# Altium schematic sheet STM32F103C8T6.SchDoc
size A3
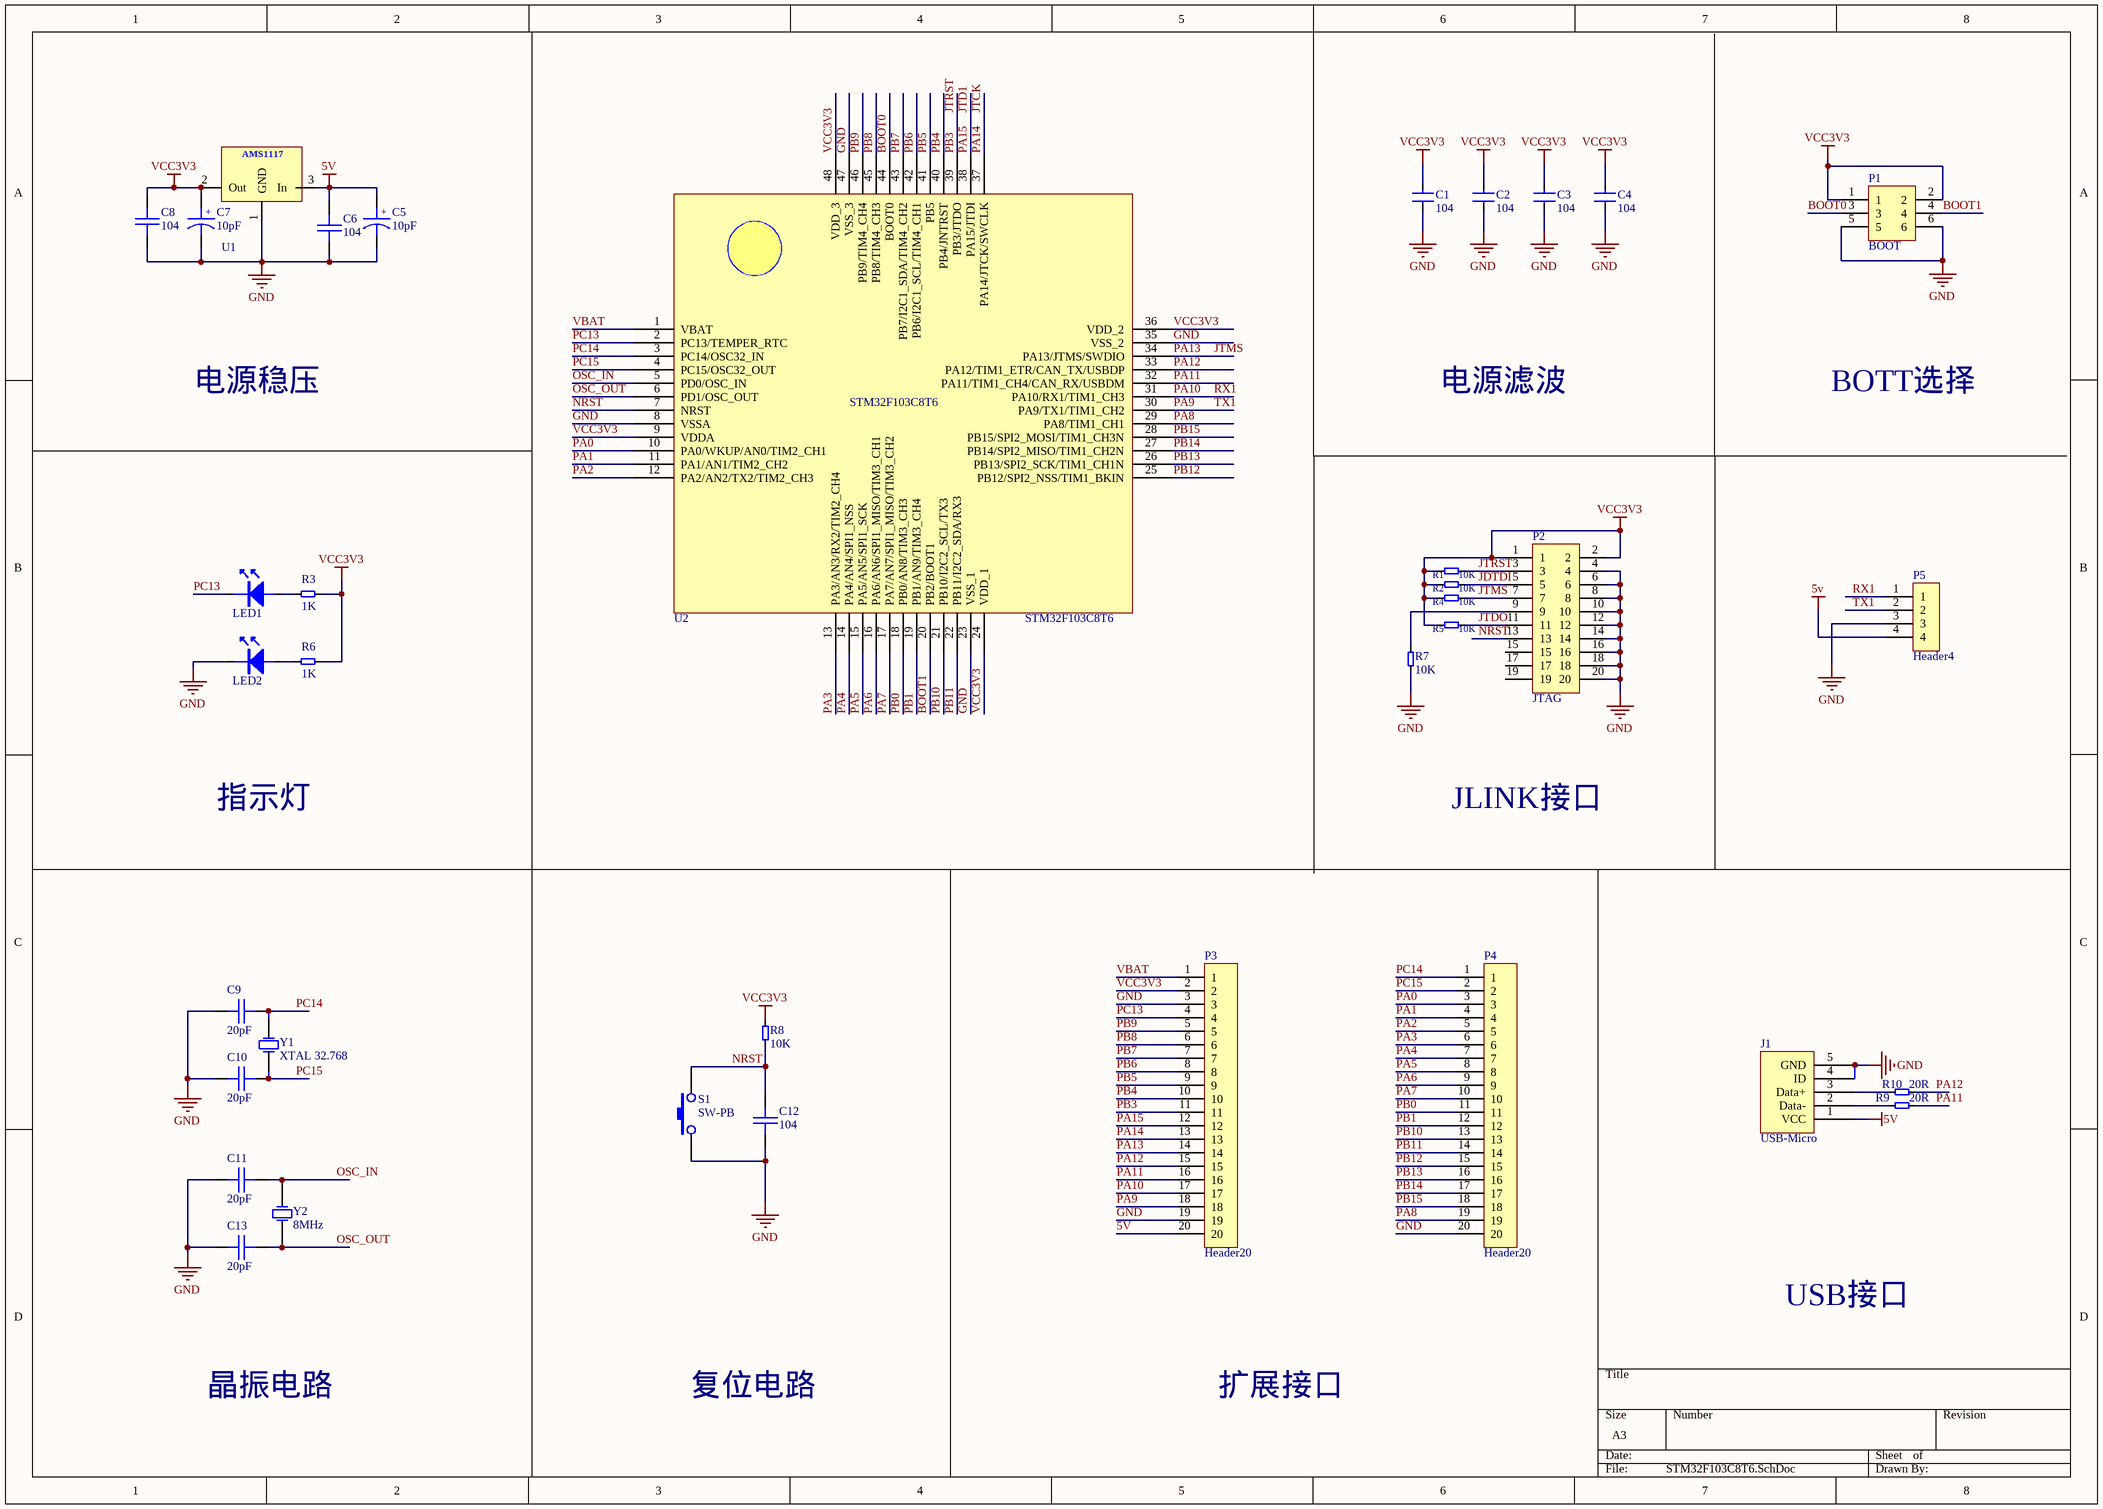
[diagram p0: STM32F103C8T6.SchDoc]

## Parts
C1  104  [0805C]
C2  104  [0805C]
C3  104  [0805C]
C4  104  [0805C]
C5  10pF  [SMT_C_Tantalum_B]
C6  104  [0805-0C]
C7  10pF  [SMT_C_Tantalum_B]
C8  104  [0805-0C]
C9  20pF  [0805-0C]
C10  20pF  [0805-0C]
C11  20pF  [0805-0C]
C12  104  [0805-0C]
C13  20pF  [0805-0C]
J1  USB-Micro  [USB-MICRO贴片]
LED1  SMT_LED_0805  [0805LED1]  (value not drawn)
LED2  SMT_LED_0805  [0805LED1]  (value not drawn)
P1  BOOT  [2.54排针2X3]
P2  JTAG  [2.54简易牛角座20p]
P3  Header20  [2.54排针1X20]
P4  Header20  [2.54排针1X20]
P5  Header4  [2.54排针1X4]
R1  10K  [R0805]
R2  10K  [R0805]
R3  1K  [R0805]
R4  10K  [R0805]
R5  10K  [R0805]
R6  1K  [R0805]
R7  10K  [R0805]
R8  10K  [R0805]
R9  20R  [R0805]
R10  20R  [R0805]
S1  SW-PB  [按键微动开关2]
U1  AMS1117  [AMS1117]  (value not drawn)
U2  STM32F103C8T6  [LQF48_M]
Y1  XTAL 32.768  [AT26]
Y2  8MHz  [TP_8M]

## Nets
5V: C5.1 C6.1 J1.1(VCC) P3.20 P5.4 U1.3(In)
GND: C1.2 C2.2 C3.2 C4.2 C5.2 C6.2 C7.2 C8.2 C9.1 C10.1 C11.1 C12.2 C13.1 J1.4(ID) J1.5(GND) LED2.2(K) P1.5 P1.6 P2.4 P2.6 P2.8 P2.10 P2.12 P2.14 P2.16 P2.18 P2.20 P3.3 P3.19 P4.20 P5.3 R7.1 S1.1 U1.1(GND) U2.8(VSSA) U2.23(VSS_1) U2.35(VSS_2) U2.47(VSS_3)
VCC3V3: C1.1 C2.1 C3.1 C4.1 C7.1 C8.1 P1.1 P1.2 P2.1 P2.2 P3.2 R1.1 R2.1 R3.2 R4.1 R5.1 R6.1 R8.2 U1.2(Out) U2.9(VDDA) U2.24(VDD_1) U2.36(VDD_2) U2.48(VDD_3)
BOOT0: P1.3 U2.44(BOOT0)
BOOT1: P1.4 U2.20(PB2/BOOT1)
JDTDI: P2.5 R2.2
JTCK: P3.13 U2.37(PA14/JTCK/SWCLK)  [also labelled PA14]
JTD1: P3.12 U2.38(PA15/JTDI)  [also labelled PA15]
JTDO: P2.11 R5.2
JTMS: P2.7 P3.14 R4.2 U2.34(PA13/JTMS/SWDIO)  [also labelled PA13]
JTRST: P2.3 P3.11 R1.2 U2.39(PB3/JTDO)  [also labelled PB3]
NRST: C12.1 P2.13 R8.1 S1.2 U2.7(NRST)
OSC_IN: C11.2 U2.5(PD0/OSC_IN) Y2.2
OSC_OUT: C13.2 U2.6(PD1/OSC_OUT) Y2.1
PA0: P4.3 U2.10(PA0/WKUP/AN0/TIM2_CH1)
PA1: P4.4 U2.11(PA1/AN1/TIM2_CH2)
PA2: P4.5 U2.12(PA2/AN2/TX2/TIM2_CH3)
PA3: P4.6 U2.13(PA3/AN3/RX2/TIM2_CH4)
PA4: P4.7 U2.14(PA4/AN4/SPI1_NSS)
PA5: P4.8 U2.15(PA5/AN5/SPI1_SCK)
PA6: P4.9 U2.16(PA6/AN6/SPI1_MISO/TIM3_CH1)
PA7: P4.10 U2.17(PA7/AN7/SPI1_MISO/TIM3_CH2)
PA8: P4.19 U2.29(PA8/TIM1_CH1)
PA9: P3.18 P5.2 U2.30(PA9/TX1/TIM1_CH2)  [also labelled TX1]
PA10: P3.17 P5.1 U2.31(PA10/RX1/TIM1_CH3)  [also labelled RX1]
PA11: P3.16 R9.2 U2.32(PA11/TIM1_CH4/CAN_RX/USBDM)
PA12: P3.15 R10.2 U2.33(PA12/TIM1_ETR/CAN_TX/USBDP)
PB0: P4.11 U2.18(PB0/AN8/TIM3_CH3)
PB1: P4.12 U2.19(PB1/AN9/TIM3_CH4)
PB4: P3.10 U2.40(PB4/JNTRST)
PB5: P3.9 U2.41(PB5)
PB6: P3.8 U2.42(PB6/I2C1_SCL/TIM4_CH1)
PB7: P3.7 U2.43(PB7/I2C1_SDA/TIM4_CH2)
PB8: P3.6 U2.45(PB8/TIM4_CH3)
PB9: P3.5 U2.46(PB9/TIM4_CH4)
PB10: P4.13 U2.21(PB10/I2C2_SCL/TX3)
PB11: P4.14 U2.22(PB11/I2C2_SDA/RX3)
PB12: P4.15 U2.25(PB12/SPI2_NSS/TIM1_BKIN)
PB13: P4.16 U2.26(PB13/SPI2_SCK/TIM1_CH1N)
PB14: P4.17 U2.27(PB14/SPI2_MISO/TIM1_CH2N)
PB15: P4.18 U2.28(PB15/SPI2_MOSI/TIM1_CH3N)
PC13: LED1.2(K) P3.4 U2.2(PC13/TEMPER_RTC)
PC14: C9.2 P4.1 U2.3(PC14/OSC32_IN) Y1.1
PC15: C10.2 P4.2 U2.4(PC15/OSC32_OUT) Y1.2
VBAT: P3.1 U2.1(VBAT)
NetJ1_2: J1.2(Data-) R9.1
NetJ1_3: J1.3(Data+) R10.1
NetLED1_1: LED1.1(A) R3.1
NetLED2_1: LED2.1(A) R6.2
NetP2_9: P2.9 R7.2

Not connected (* = marked no-connect by the designer): P2 15 17 19

## Notes on the sheet
- 电源稳压
- 电源滤波
- BOTT选择
- 指示灯
- JLINK接口
- USB接口
- 晶振电路
- 复位电路
- 扩展接口
- (in symbol SMT_C_Tantalum_B) +

## Library data of the parts
C1-C4 = C0805
C5 C7 = SMT_C_Tantalum_B: Capacitor, SM Tantalum; Body 3.5 x 2.8 mm (LxW typ)
C6 C8-C13 = SMT_C_0805: Surface mount capacitor 0805
LED1 LED2 = SMT_LED_0805: SMT LED
P1 = PIN-6
P2 = PIN-20
P3 P4 = SIP-20
P5 = SIP-4
R1-R10 = R0805
S1 = 微动开关2P
U2 = STM32F103C8T6: ARM 32bit LQFP48
Y2 = XTAL